# EAGLE design Schema_elettrico (EAGLE 5.11)
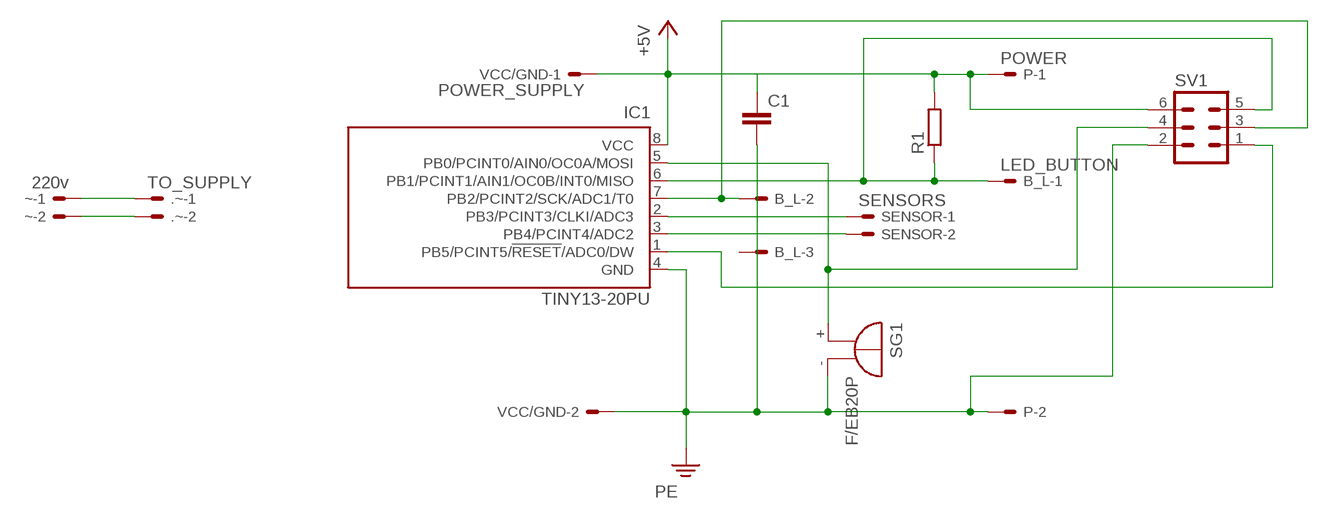
[diagram p0: schematic, sheet 1]

## Parts
.~  TO_SUPPLY  22-27-2021-02  [6410-02]
B_L  LED_BUTTON  22-23-2031  [22-23-2031]
C1  C-EUC4532  [C4532]
IC1  TINY13-20PU  [DIL08]
P  POWER  22-23-2021  [22-23-2021]
R1  R-EU_M1406  [M1406]
SENSOR  SENSORS  22-23-2021  [22-23-2021]
SG1  F/EB20P  [F/EB20P]
SV1  ML6  [ML6]
VCC/GND  POWER_SUPPLY  22-27-2021-02  [6410-02]
~  220v  22-23-2021  [22-23-2021]

## Nets
+5V: C1.1 IC1.8(VCC) P.1 R1.2 SV1.6 VCC/GND.1
N$2: IC1.5(PB0/PCINT0/AIN0/OC0A/MOSI) SG1.+ SV1.4
N$4: B_L.1 IC1.6(PB1/PCINT1/AIN1/OC0B/INT0/MISO) R1.1 SV1.5
N$5: IC1.2(PB3/PCINT3/CLKI/ADC3) SENSOR.1
N$6: IC1.3(PB4/PCINT4/ADC2) SENSOR.2
N$7: .~.1 ~.1
N$8: .~.2 ~.2
N$13: B_L.2 IC1.7(PB2/PCINT2/SCK/ADC1/T0) SV1.3
N$17: C1.2 IC1.4(GND) P.2 SG1.- SV1.2 VCC/GND.2 ; supply symbol labelled PE
N$21: IC1.1(PB5/PCINT5/!RESET!/ADC0/DW) SV1.1
Unconnected: B_L.3

## Library data of the parts
.~ VCC/GND = con-molex:22-?-02: CONNECTOR wire to board 2.54 mm (.1 inch) pitch header; OC_FARNELL: unknown; OC_NEWARK: unknown
B_L = con-molex:22-23-2031: .100" (2.54mm) Center Header - 3 Pin; MF: MOLEX; MPN: 22-23-2031; OC_FARNELL: 1462950; OC_NEWARK: 30C0862
C1 = resistor:C-EU: CAPACITOR, European symbol
IC1 = atmel:TINY13: 8-bit AVR Microcontroller with 1K Bytes In-System Programmable Flash Source: http://www.atmel.com/dyn/resources/prod_documents/2535S.pdf; MPN: ATTINY13-20PU; OC_FARNELL: 9171550; OC_NEWARK: 96K6521
P SENSOR ~ = con-molex:22-23-2021: .100" (2.54mm) Center Header - 2 Pin; MF: MOLEX; MPN: 22-23-2021; OC_FARNELL: 1462926; OC_NEWARK: 25C3832
R1 = resistor:R-EU_: RESISTOR, European symbol
SG1 = buzzer:F/EB20P: BUZZER Source: Buerklin; OC_FARNELL: unknown; OC_NEWARK: unknown
SV1 = con-ml:ML6: HARTING; OC_FARNELL: unknown; OC_NEWARK: unknown

## Board
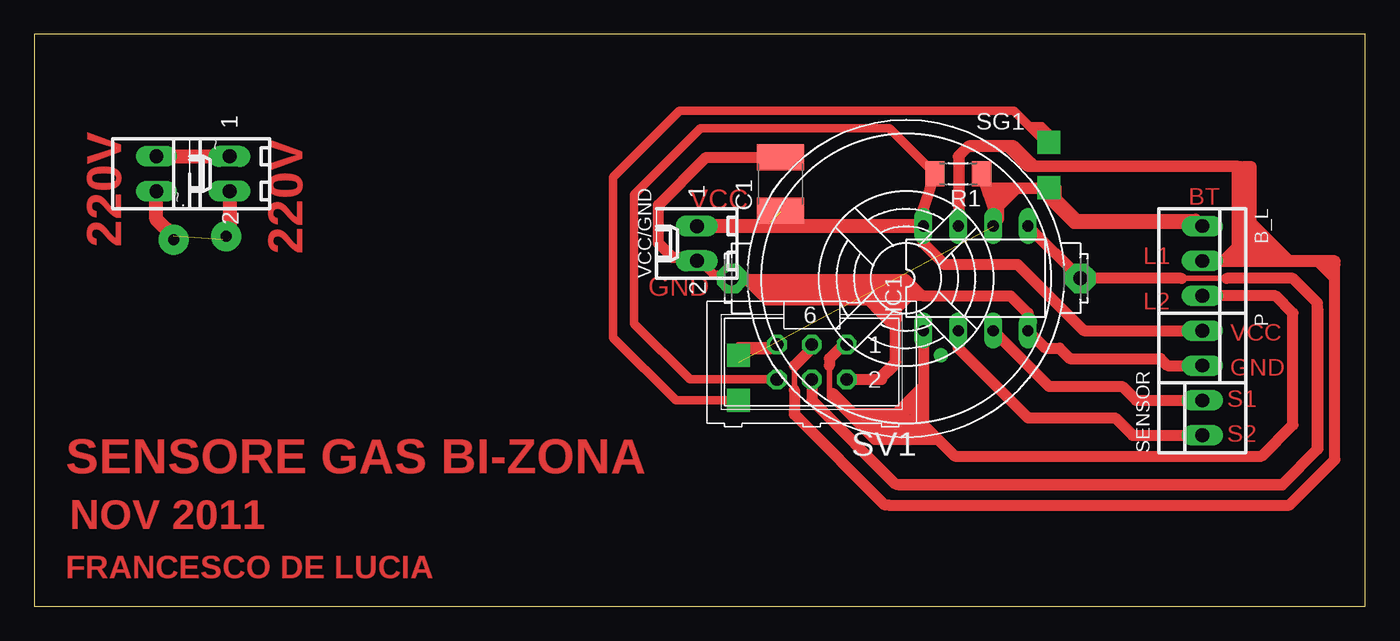
[diagram p1: board, top side]

Size 96.95 x 41.65 mm. Coordinates in mm from the lower left corner, seen from the top.
Outline: 0,0 96.95,0 96.95,41.65 0,41.65 0,0
Copper layers (1*16): Top 0.035mm / dielectric 1.5mm / Bottom 0.035mm
Design rules "default": minimum track width 10mil, minimum drill 24mil, track to track 8mil, track to pad 8mil, pad to pad 8mil, via to via 8mil, smd to smd 8mil, copper to edge 40mil, drill to drill 8mil, minimum pad ring 10mil, minimum via ring 8mil, stop-mask expansion 4mil, vias tented up to drill 0mil, thermal gap 10mil

### Footprints (pad centres in the part's own frame; a part is rotated, then mirrored left to right if it is on the bottom)
6410-02 = drill 1.016 long: 1 1.27,0; 2 -1.27,0
22-23-2031 = drill 1 long: 1 -2.54,0; 2 0,0; 3 2.54,0
C4532 = smd 1.9 x 3.4: 1 -1.95,0; 2 1.95,0
DIL08 = drill 0.813 long: 1 -3.81,-3.81; 2 -1.27,-3.81; 3 1.27,-3.81; 4 3.81,-3.81; 5 3.81,3.81; 6 1.27,3.81; 7 -1.27,3.81; 8 -3.81,3.81
22-23-2021 = drill 1 long: 1 -1.27,0; 2 1.27,0
M1406 = smd 1.4 x 1.8: 1 -1.7,0; 2 1.7,0
F/EB20P = drill 1.016 pad 2.159 octagon: + 12.7,0; - -12.7,0
ML6 = drill 0.914 octagon: 1 -2.54,-1.27; 2 -2.54,1.27; 3 0,-1.27; 4 0,1.27; 5 2.54,-1.27; 6 2.54,1.27

### Placement (x,y rotation side)
.~  14.22,31.5 90 top
B_L  85.09,25.15 270 top
C1  54.36,30.73 90 top
IC1  68.58,23.88 0 top
P  85.09,18.8 270 top
R1  67.31,31.5 180 top
SENSOR  85.09,13.72 90 top
SG1  63.5,23.88 0 top
SV1  56.64,17.78 180 top
VCC/GND  48.26,26.42 90 top
~  8.89,31.5 270 top

### Tracks (layer width: path | path; a pad name or v marks a point on that pad's centre or on a via)
+5V
  Top 0.61: SV1.6 47.75,16.51 43.69,20.57 43.69,29.97 48.51,34.8 62.31,34.8 R1.2
  Top 0.813: R1.2 64.77,28.96 IC1.8 64.77,26.42 66.29,24.89 71.63,24.89 76.45,20.07 P.1
  Top 1.016: IC1.8 54.1,27.69 | 54.1,27.69 VCC/GND.1 | C1.1 53.93,27.86 54.1,27.69
N$1
  Top 0.406: 74.17,29.97 74.17,29.46 74.42,29.21 74.42,29.97 73.66,29.97 | 73.66,29.97 73.41,30.23 74.42,30.23 | 73.66,29.97 73.91,29.72
N$2
  Top 0.406: 62.74,8.89 62.99,8.64 90.93,8.64 93.73,11.43 93.73,21.59 93.47,21.84 91.44,23.88 86.87,23.88 83.57,23.88
  Top 0.813: IC1.5 SG1.+ 83.57,23.88 | SV1.4 56.64,14.99 62.74,8.89 90.93,8.89 93.47,11.43 93.47,21.84 93.47,22.1 91.69,23.88 86.87,23.88
N$3
  Top 0.406: 59.94,14.22 62.74,14.22 64.52,16 64.52,15.49 | 64.52,13.97 64.52,13.46 63.5,12.45 61.72,12.45 60.2,13.97 62.99,13.97 64.52,15.49 | 64.52,15.49 64.52,14.99 | 64.52,14.48 64.52,13.97 | 64.52,13.97 63.25,12.7 61.72,12.7 60.71,13.72 61.21,13.72 | 61.21,13.72 63.25,13.72 | 63.25,13.72 64.52,14.99 | 64.52,14.99 64.52,14.48 | 64.52,14.48 64.01,13.97 64.01,13.72 | 64.01,13.72 63.25,12.95 61.72,12.95 61.72,13.21 | 61.72,13.21 61.21,13.72 | 63.25,13.72 63.75,13.72 | 64.01,13.72 63.75,13.72 | 63.75,13.72 63.25,13.21 62.99,13.21 | 61.72,13.21 62.99,13.21 | 62.99,13.21 63.25,13.46 61.72,13.46
N$4  (1 unrouted)
  Top 0.406: B_L.1 75.69,27.69 73.15,30.23 71.63,30.23 | 71.12,30.23 69.7,30.23 69.5,30.03 | 52.58,19.05 SV1.5 53.59,18.54 53.34,18.54 | 52.32,18.8 51.31,17.78 | 52.32,18.54 53.34,18.54 | 53.34,18.54 53.59,18.8 52.32,18.8 | 51.56,18.8 52.32,18.8 | 52.32,18.8 52.58,19.05 | 52.58,19.05 51.31,19.05 50.8,18.54 | 70.36,28.19 70.36,28.96 71.63,30.23 | 71.63,30.23 71.12,30.23 | 71.12,30.23 70.36,29.46
  Top 0.61: 69.85,28.96 69.85,29.97 70.36,29.97 70.36,29.46 70.36,28.19 70.1,27.94
  Top 0.813: IC1.6 69.85,28.96 69.5,30.03 69.47,30.1 R1.1
N$5
  Top 0.813: SENSOR.1 80.01,12.45 78.74,13.72 75.44,13.72 74.93,13.72 72.39,13.72 67.31,18.8 IC1.2
N$6
  Top 0.813: SENSOR.2 80.26,14.99 79.25,16 73.91,16 IC1.3
N$7
  Top 1.016: ~.1 .~.1
N$8  (1 unrouted)
  Top 1.016: ~.2 8.89,28.19 10.16,26.92 | .~.2 14.22,27.18 13.72,26.67
N$9  (via drill 0 pad 1.68)
  other vias: 51.31,18.29
N$10  (via drill 0 pad 1.68)
  Top 0.61: v51.31,14.99 46.74,14.99 42.16,19.56 42.16,31.24 46.99,36.07 71.37,36.07 73.91,33.53
N$11  (via drill 0.01 pad 1.68)
  other vias: 73.91,30.48
N$12  (via drill 0.01 pad 1.68)
  other vias: 73.91,33.78
N$13
  Top 0.406: 85.6,25.15 86.36,25.15 87.88,26.67 87.88,28.7 88.39,29.21 88.39,31.24 87.38,32.26 | 85.6,25.15 B_L.2 | 87.38,32.26 72.64,32.26 71.63,33.27 68.07,33.27 67.56,32.77 67.56,27.94 IC1.7 | SV1.3 56.64,18.54 55.37,17.27 55.37,15.75 | 55.37,14.22 62.23,7.37 | 94.74,10.67 94.74,23.62 | 94.74,24.13 94.74,24.64 94.49,24.89 93.47,24.89 | 88.9,24.89 85.85,24.89 85.6,25.15 | 87.88,26.16 87.88,25.91 88.14,25.65 | 88.14,25.65 88.65,25.15 88.39,25.15 88.14,25.4 | 88.14,25.4 88.39,25.4 88.9,24.89 | 93.47,24.89 88.9,24.89 | 93.47,24.89 94.74,23.62 | 94.74,23.62 94.74,24.13 | 94.74,24.13 94.49,24.38 94.23,24.38 93.98,24.64 94.49,24.64 | 88.14,25.4 88.14,25.65 | 88.14,25.65 88.14,28.96 88.65,29.46 88.65,31.24 87.88,32 87.63,32.26 87.38,32.26 | 88.65,28.19 91.44,25.4 89.41,25.4 88.9,25.91 | 88.9,25.91 88.9,27.18 89.15,27.43 90.93,25.65 89.41,25.65 89.41,26.92 89.15,27.18 89.15,26.16 90.17,26.16 90.42,25.91 89.92,25.91 89.66,25.91 | 89.66,25.91 89.66,26.67 89.92,26.42 | 88.9,25.91 89.66,25.91
  Top 0.61: 87.88,26.67 87.88,26.16 87.88,25.15 86.87,25.15 87.63,25.91
  Top 0.813: 70.87,33.53 71.37,33.53 72.64,32.26 | 88.14,25.4 88.65,25.4 88.65,28.19 88.65,32 88.14,32 | 72.39,32 87.88,32 88.14,32 | 72.39,32 72.39,32.26 | 88.14,32 88.14,25.65 87.63,25.65 87.63,31.75 | IC1.7 67.31,32.77 68.07,33.53 70.87,33.53 | 70.87,33.53 72.39,32 | SV1.3 56.64,18.8 55.37,17.53 | 55.37,15.75 55.37,14.22 55.37,13.97 61.98,7.37 | 62.23,7.37 91.44,7.37 94.74,10.67 94.74,24.89 | 94.74,25.15 88.39,25.15
N$14  (1 unrouted)
N$15  (via drill 0.8 pad 2.18)
  other vias: 10.16,26.67
N$16  (via drill 0.8 pad 2.18)
  other vias: 13.97,26.92
N$17
  Top 0.406: 50.8,23.62 51.82,23.62 53.34,22.1 61.21,22.1 | 61.72,22.61 61.21,23.11 61.21,22.86 | 61.21,22.86 61.72,22.35 | 61.21,22.86 60.45,23.62 60.96,23.62 61.72,22.86 62.74,22.86 | 59.44,23.88 59.44,23.37 62.74,20.07 62.74,20.57 61.21,22.1 | 61.21,22.1 59.69,23.62 59.94,23.62 60.71,22.86 61.47,22.1 | 62.99,20.83 62.99,21.59 64.01,22.61 63.5,22.61 62.99,22.1
  Top 0.61: 63.25,23.88 59.44,23.88 SG1.- 50.55,24.13 49.53,24.13 48.51,25.15 VCC/GND.2 | 63.25,23.88 63.5,23.88 64.77,22.61 | 61.72,16.51 62.74,17.53 62.74,17.78 | 62.74,22.86 62.74,23.37 63.25,23.88 | 62.74,22.86 62.74,22.61 | 62.99,22.61 62.99,23.11 | 62.99,23.11 63.25,23.37 63.75,23.37 64.01,23.11 62.99,23.11 | 62.74,22.86 62.99,23.11 | 62.74,22.86 62.23,22.86 61.47,23.62 62.23,23.62 62.48,23.37
  Top 0.813: 62.74,22.61 62.99,22.61 64.01,22.61 64.77,22.61 71.12,22.61 72.39,21.34 IC1.4 73.66,18.8 74.68,18.8 75.44,18.03 82.04,18.03 82.55,17.53 P.2 | 62.23,22.61 61.72,22.61 | C1.2 48.94,32.68 45.47,29.21 45.47,26.42 46.48,25.4 48.01,25.4 VCC/GND.2 | SV1.2 61.72,16.51 61.72,16.76 62.74,17.78 62.74,20.07 62.74,22.61 | 62.74,22.61 62.23,22.61 | 62.23,22.61 61.98,22.35 61.98,21.59 62.48,21.08
  Top 1.422: 60.71,22.86 53.34,22.86 52.83,23.37
N$18
  Top 0.406: 72.9,35.05 73.41,35.05 74.17,34.29 74.17,33.78 | 74.17,33.53 74.17,33.78 | 74.17,33.78 72.9,35.05 | 72.9,35.05 72.64,35.05
N$19  (via drill 0.01 pad 1.02)
  other vias: 66.04,18.29
N$20
  Top 0.813: 69.6,30.48 74.42,30.48 74.42,29.72 75.95,28.19 84.58,28.19 84.84,27.94
N$21
  Top 0.406: 57.91,17.53 57.91,15.24 61.21,11.94 63.5,11.94 | 63.5,11.94 63.75,12.19 64.77,13.21 | 64.77,13.21 64.77,13.46 | 64.77,13.46 IC1.1 | 63.5,11.94 65.79,11.94 | 65.79,11.94 66.8,10.92 67.06,10.92 | 91.69,13.21 91.69,21.08 90.17,22.61 86.36,22.61 85.34,22.61 85.09,22.35 | 64.77,12.95 64.77,12.19 | 64.77,12.19 64.01,12.19 64.52,12.7 | 65.79,11.94 65.79,12.45 64.77,13.46 | 64.77,13.21 64.77,12.95 | 64.77,12.95 65.53,12.19 64.77,12.19 | 64.77,12.19 64.52,12.45 65.02,12.45
  Top 0.813: IC1.1 64.77,12.95 | 65.53,12.45 67.06,10.92 89.41,10.92 91.69,13.21 91.69,21.34 90.42,22.61 86.36,22.61 | 63.75,12.19 61.47,12.19 58.17,15.49 | SV1.1 58.93,19.05 57.91,18.03 57.91,17.53

### Text on the board
Top: BT | VCC | 220V | 220V | L1 | GND | L2 | VCC | GND | S1 | S2 | SENSORE GAS BI-ZONA | NOV 2011 | FRANCESCO DE LUCIA